# EAGLE design Case-Hack-PCB (EAGLE 9.7.0)
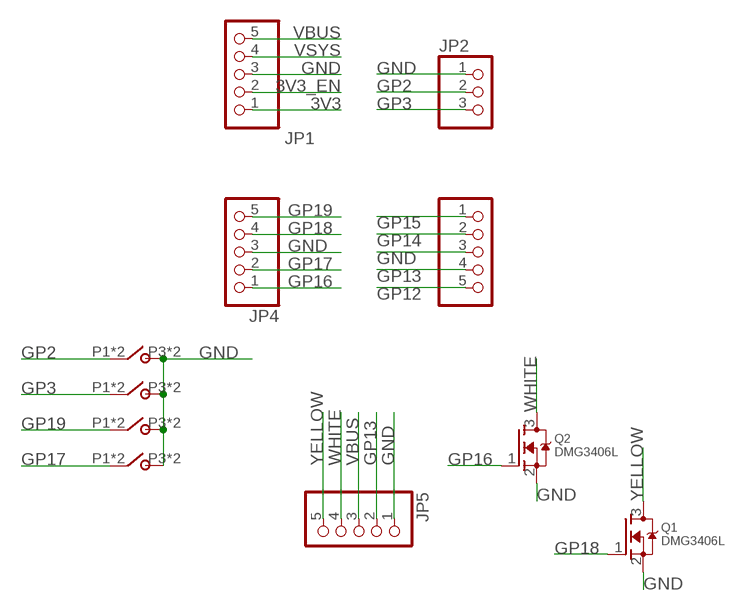
[diagram p0: schematic, sheet 1]

## Parts
JP1  HEADER-1X5ROUND  [1X05_ROUND]
JP2  HEADER-1X3ROUND  [1X03_ROUND]
JP3  HEADER-1X5ROUND  [1X05_ROUND]
JP4  HEADER-1X5ROUND  [1X05_ROUND]
JP5  HEADER-1X5ROUND  [1X05_ROUND]
Q1  DMG3406L  MOSFET-NWIDE  [SOT23-WIDE]
Q2  DMG3406L  MOSFET-NWIDE  [SOT23-WIDE]
U$1  K2-1109SP-B4SA-01  [K2-1109SP-B4SA-01]
U$2  K2-1109SP-B4SA-01  [K2-1109SP-B4SA-01]
U$3  K2-1109SP-B4SA-01  [K2-1109SP-B4SA-01]
U$4  K2-1109SP-B4SA-01  [K2-1109SP-B4SA-01]

## Nets
3V3: JP1.1
3V3_EN: JP1.2
GND: JP1.3 JP2.1 JP3.3 JP4.3 JP5.1 Q1.2(S) Q2.2(S) U$1.P3 U$1.P4 U$2.P3 U$2.P4 U$3.P3 U$3.P4 U$4.P3 U$4.P4
GP2: JP2.2 U$1.P1 U$1.P2
GP3: JP2.3 U$2.P1 U$2.P2
GP12: JP3.5
GP13: JP3.4 JP5.2
GP14: JP3.2
GP15: JP3.1
GP16: JP4.1 Q2.1(G)
GP17: JP4.2 U$4.P1 U$4.P2
GP18: JP4.4 Q1.1(G)
GP19: JP4.5 U$3.P1 U$3.P2
VBUS [vbus]: JP1.5 JP5.3
VSYS: JP1.4
WHITE: JP5.4 Q2.3(D)
YELLOW: JP5.5 Q1.3(D)

## Library data of the parts
JP1 JP3-JP5 = microbuilder:HEADER-1X5: PIN HEADER
JP2 = microbuilder:HEADER-1X3: PIN HEADER
Q1 Q2 = microbuilder:MOSFET-N: N-Channel Mosfet LEGEND VDS: Voltage Drain-Source ID: Drain Current RDS(ON): Drain-Source On-State Resistance VGS(TH): Gate-Source Threshold Voltage CISS: Drain-Source Input Capacitance SOT-23 Name VDS ID RDS(ON) VGS(TH) CISS Order Number 2N7002E 60V 260mA 2.5 Ohm 2.5V @ 250uA 26.7pF @ 25V 2N7002ET1GOSTR-ND BSH103 30V 850mA 400 mOhm 400mV @ 1mA 83pF @ 24V BSH103,235-ND BSS138 60V 320mA 1.6 Ohm 1.5V @ 250uA 50pF @ 10V Mouser: 771-BSS138PW115 DMN2075U-7 20V 4.2A 38 mOhm 1V @ 250 uA 594.3pF @ 10V DMN2075U-7DICT-ND * BSS138 good choice for I2C level-shifting
U$1-U$4 = Custom-Parts:K2-1109SP-B4SA-01

## Net classes
1 vbus: clearance 0.254 mm

## Board
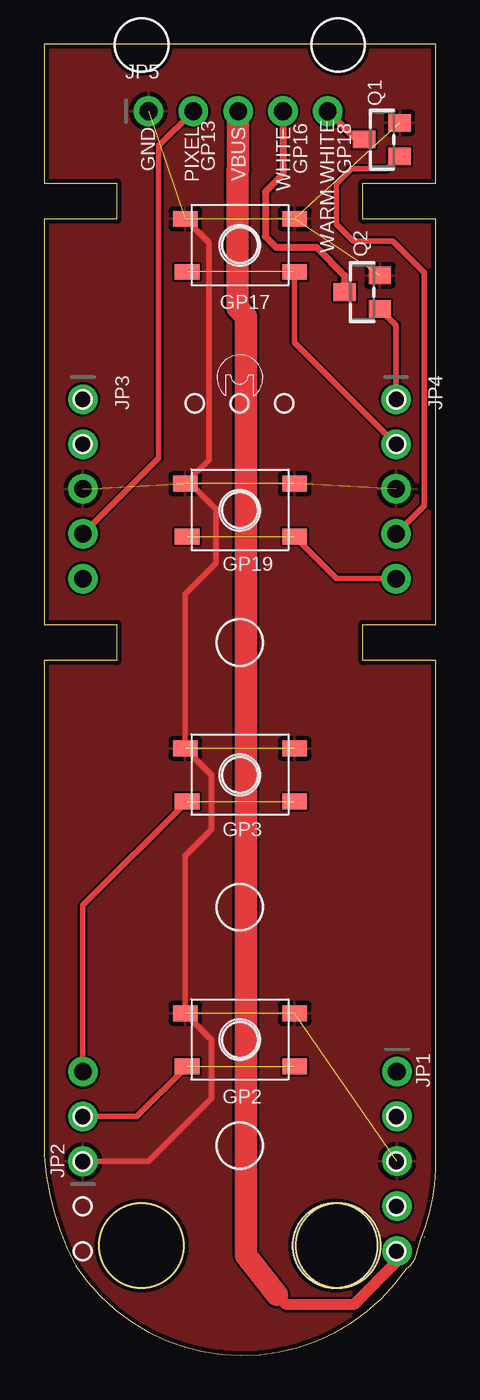
[diagram p1: board, top side]

Size 22.2 x 74.28 mm. Coordinates in mm from the lower left corner, seen from the top.
Outline: 21.57,6.7 arc1 21.57,6.7
Outline: 1.8,5.08 arc112 20.55,4.93 20.67,5.02 arc37 21.11,5.69 21.35,6.58 arc24 22.2,11.28 22.2,39.35 18.07,39.35 18.07,41.4 22.2,41.4 22.2,64.35 18.07,64.35 18.07,66.4 22.2,66.4 22.2,74.28 0,74.28 0,66.4 4.12,66.4 4.12,64.35 0,64.35 0,41.4 4.12,41.4 4.12,39.35 0,39.35 0,11.28 arc24 1.8,5.08
Copper layers (1*16): Top 0.035mm / dielectric 0.8mm / Bottom 0.035mm
Design rules "jlc-2layer *": minimum track width 6mil, minimum drill 0.3mm, track to track 5mil, track to pad 5mil, pad to pad 5mil, via to via 0mil, smd to smd 0mil, copper to edge 0.25mm, drill to drill 10mil, minimum pad ring 10mil, minimum via ring 0.15mm, stop-mask expansion 2mil, vias tented up to drill 100mil, thermal gap 10mil
Holes 4.8 mm at 16.51,6.23 5.53,6.23
Holes 3 mm at 5.53,74.23 16.68,74.23
Milling: area 14.3,3.8 to 19.1,8.6; area 3.1,3.8 to 7.9,8.6

### Footprints (pad centres in the part's own frame; a part is rotated, then mirrored left to right if it is on the bottom)
1X05_ROUND = drill 1 pad 1.676: 1 -5.08,0; 2 -2.54,0; 3 0,0; 4 2.54,0; 5 5.08,0
1X03_ROUND = drill 1 pad 1.676: 1 -2.54,0; 2 0,0; 3 2.54,0
SOT23-WIDE = smd 1 x 1.27: 1 -0.95,-1; 2 0.95,-1; 3 0,1
K2-1109SP-B4SA-01 = smd 1.4 x 0.9: P1 0.7,0; P2 6.8,0; P3 0.6,3; P4 6.8,3

### Placement (x,y rotation side)
JP1  20,11 270 top
JP2  2.2,13.53 90 top
JP3  2.2,49.08 270 top
JP4  19.95,49.08 270 top
JP5  11,70.48 0 top
Q1  19.15,68.87 90 top
Q2  18.03,60.23 90 top
U$1  7.4,16.38 0 top
U$2  7.4,31.38 0 top
U$3  7.4,46.38 0 top
U$4  7.4,61.38 0 top

### Tracks (layer width: path | path; a pad name or v marks a point on that pad's centre or on a via)
GND  (10 unrouted)
  Top 0.305: JP2.1 5.93,10.99 9.5,14.56 9.5,17.88 U$1.P3 8,28.3 9.5,29.8 9.5,32.88 U$2.P3 8,43.13 9.75,44.88 9.75,47.93 8.31,49.38 U$3.P3 9.35,50.73 9.35,63.03 U$4.P3
  pour Top: -3,84.18 24,84.18 24,-4.82 -3,-4.82
GP2  (1 unrouted)
  Top 0.305: JP2.2 5.25,13.53 U$1.P1
GP3  (1 unrouted)
  Top 0.305: JP2.3 2.2,25.48 U$2.P1
GP13
  Top 0.305: JP5.2 6.5,68.52 6.5,50.84 JP3.4
GP16
  Top 0.305: JP4.1 19.95,58.36 Q2.1
GP17  (1 unrouted)
  Top 0.305: JP4.2 14.2,57.37 U$4.P2
GP18
  Top 0.305: JP4.4 21.54,48.13 21.54,61.34 19.76,63.12 17.53,63.12 16.56,64.09 16.56,66.37 17.42,67.24 19.47,67.24 Q1.1
GP19  (1 unrouted)
  Top 0.305: JP4.5 16.58,44 U$3.P2
VBUS
  Top 0.61: JP1.5 20,5.33 17.55,2.88 13.75,2.88 13.2,3.43
  Top 1.27: 13.2,3.43 11.46,5.68 11.46,58.85 10.95,59.35 10.95,67.13 11,67.18 JP5.3
WHITE
  Top 0.406: Q2.3 17.04,61.17 15.44,62.77 13.16,62.77 12.55,63.37 12.55,65.91 13.54,66.91 JP5.4
YELLOW
  Top 0.406: Q1.3 17.69,68.87 JP5.5

### Text on the board
tPlace: GND | GP13 | GP16 | GP18 | PIXEL | VBUS | WHITE | WARM WHITE | GP17 | GP19 | GP3 | GP2